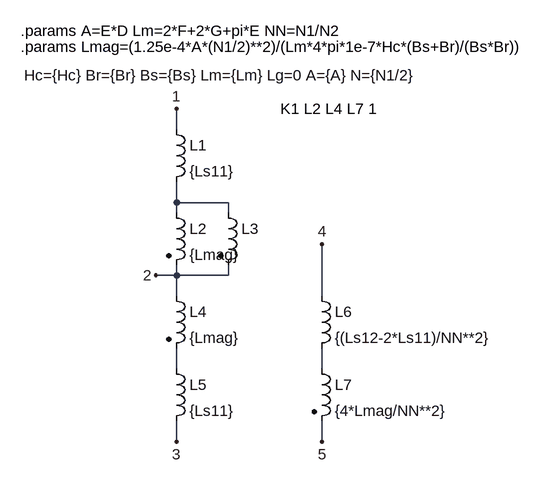
[diagram p0: schematic Draft1U.asc]
Draft1U.asc, the LTspice schematic file:
Version 4
SHEET 1 908 680
WIRE 192 -208 192 -240
WIRE 192 -96 192 -128
WIRE 272 -96 192 -96
WIRE 192 -80 192 -96
WIRE 272 -80 272 -96
WIRE 192 16 192 0
WIRE 192 16 160 16
WIRE 272 16 272 0
WIRE 272 16 192 16
WIRE 192 48 192 16
WIRE 416 48 416 -32
WIRE 192 160 192 128
WIRE 416 160 416 128
WIRE 192 272 192 240
WIRE 416 272 416 240
FLAG 192 -240 1
FLAG 192 272 3
FLAG 416 -32 4
FLAG 416 272 5
FLAG 160 16 2
SYMBOL ind2 176 -96 R0
SYMATTR InstName L2
SYMATTR Value {Lmag}
SYMATTR Type ind
SYMBOL ind2 176 32 R0
SYMATTR InstName L4
SYMATTR Value {Lmag}
SYMATTR Type ind
SYMBOL ind2 256 -96 R0
WINDOW 3 -299 -196 Left 2
SYMATTR Value Hc={Hc} Br={Br} Bs={Bs} Lm={Lm} Lg=0 A={A} N={N1/2}
SYMATTR InstName L3
SYMATTR Type ind
SYMATTR SpiceLine Rser=1m
SYMBOL ind2 400 144 R0
SYMATTR InstName L7
SYMATTR Value {4*Lmag/NN**2}
SYMATTR Type ind
SYMBOL ind 176 -224 R0
SYMATTR InstName L1
SYMATTR Value {Ls11}
SYMATTR SpiceLine Rser={R1/2}
SYMBOL ind 176 144 R0
SYMATTR InstName L5
SYMATTR Value {Ls11}
SYMATTR SpiceLine Rser={R1/2}
SYMBOL ind 400 32 R0
SYMATTR InstName L6
SYMATTR Value {(Ls12-2*Ls11)/NN**2}
SYMATTR SpiceLine Rser={R2}
TEXT 352 -240 Left 2 !K1 L2 L4 L7 1
TEXT -48 -360 Left 2 !.params A=E*D Lm=2*F+2*G+pi*E NN=N1/N2
TEXT -48 -336 Left 2 !.params Lmag=(1.25e-4*A*(N1/2)**2)/(Lm*4*pi*1e-7*Hc*(Bs+Br)/(Bs*Br))

The netlist it stands for:
* Draft1U.asc
L2 N001 2 {Lmag}
L4 2 N002 {Lmag}
L3 N001 2 Hc={Hc} Br={Br} Bs={Bs} Lm={Lm} Lg=0 A={A} N={N1/2} Rser=1m
L7 N003 5 {4*Lmag/NN**2}
L1 1 N001 {Ls11} Rser={R1/2}
L5 N002 3 {Ls11} Rser={R1/2}
L6 4 N003 {(Ls12-2*Ls11)/NN**2} Rser={R2}
K1 L2 L4 L7 1
.params A=E*D Lm=2*F+2*G+pi*E NN=N1/N2
.params Lmag=(1.25e-4*A*(N1/2)**2)/(Lm*4*pi*1e-7*Hc*(Bs+Br)/(Bs*Br))
.backanno
.end